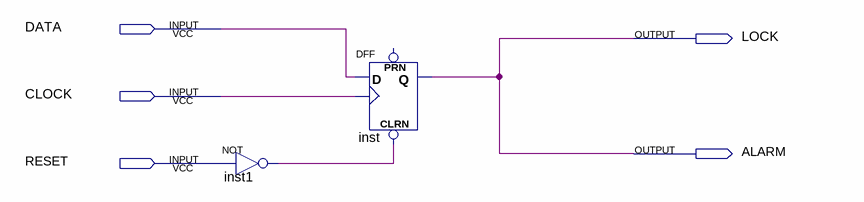
[diagram p0: schematic sheet]
// Quartus schematic dlock.bdf as structural Verilog: 2 symbols, 5 pins
module dlock (
  input  DATA,
  input  CLOCK,
  input  RESET,
  output LOCK,
  output ALARM
);

  wire inst1_out;

  not inst1 (inst1_out, RESET);
  DFF inst (.CLRN(inst1_out), .CLK(CLOCK), .D(DATA), .Q(ALARM));  // open: PRN

  assign LOCK = ALARM;
endmodule
